# EAGLE design h-bridge_v2 (EAGLE 5.06)
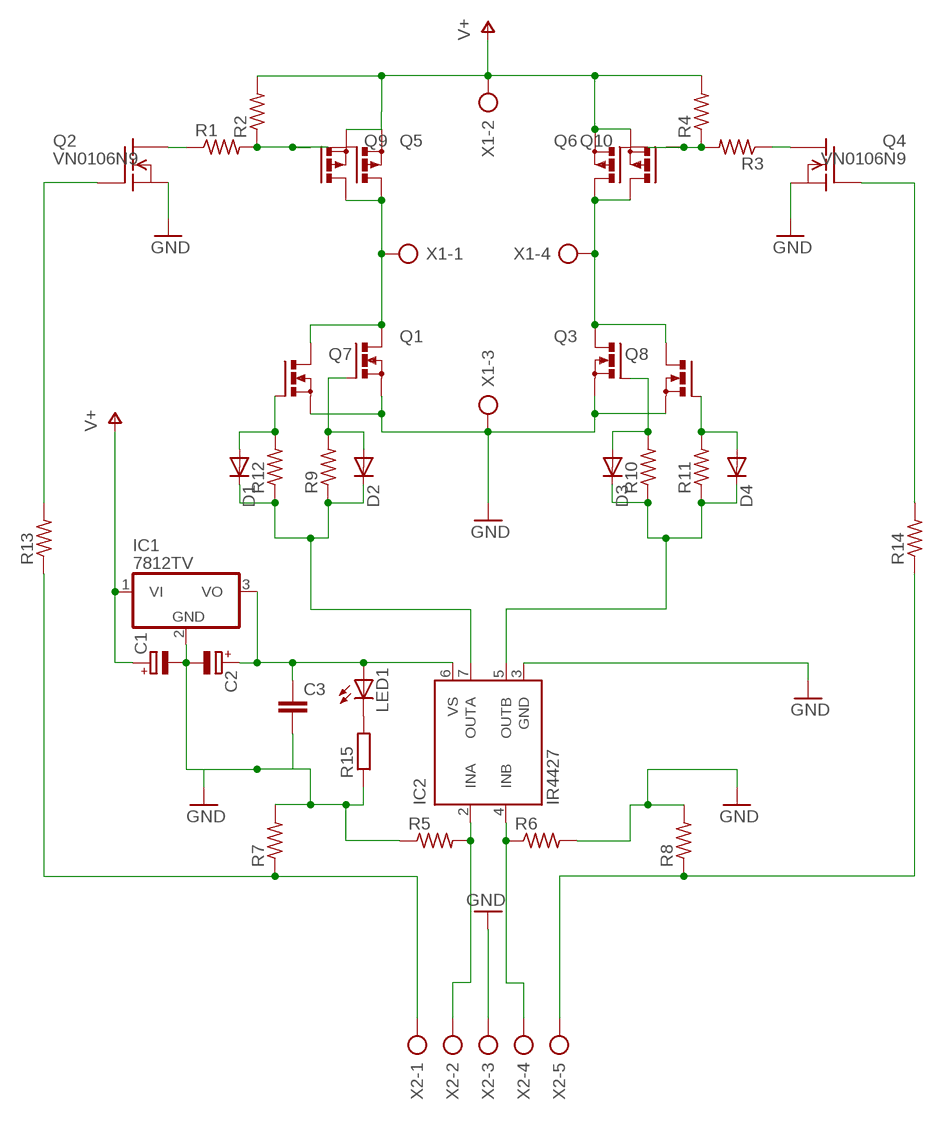
[diagram p0: schematic, sheet 1]

## Parts
C1  CPOL-EUE5-8.5  [E5-8,5]
C2  CPOL-EUE5-8.5  [E5-8,5]
C3  C-EU025-024X044  [C025-024X044]
D1  1N4148DO35-7  DIODE-D-5  [D-5]
D2  1N4148DO35-7  DIODE-D-5  [D-5]
D3  1N4148DO35-7  DIODE-D-5  [D-5]
D4  1N4148DO35-7  DIODE-D-5  [D-5]
IC1  7812TV  [TO220V]
IC2  IR4427  [DIL08]
LED1  LED3MM  [LED3MM]
Q1  PMOSFET_NTO220BV  [TO220BV]
Q2  VN0106N9  [TO-52]
Q3  PMOSFET_NTO220BV  [TO220BV]
Q4  VN0106N9  [TO-52]
Q5  PMOSFET_PTO220BV  [TO220BV]
Q6  PMOSFET_PTO220BV  [TO220BV]
Q7  PMOSFET_NTO220BV  [TO220BV]
Q8  PMOSFET_NTO220BV  [TO220BV]
Q9  PMOSFET_PTO220BV  [TO220BV]
Q10  PMOSFET_PTO220BV  [TO220BV]
R1  R-US_0204/5  [0204/5]
R2  R-US_0204/5  [0204/5]
R3  R-US_0204/5  [0204/5]
R4  R-US_0204/5  [0204/5]
R5  R-US_0204/5  [0204/5]
R6  R-US_0204/5  [0204/5]
R7  R-US_0204/7  [0204/7]
R8  R-US_0204/5  [0204/5]
R9  R-US_0204/5  [0204/5]
R10  R-US_0204/5  [0204/5]
R11  R-US_0204/5  [0204/5]
R12  R-US_0204/5  [0204/5]
R13  R-US_0204/7  [0204/7]
R14  R-US_0204/5  [0204/5]
R15  R-EU_0204/5  [0204/5]
X1  AK500/4  [AK500/4]
X2  AK500/5  [AK500/5]

## Nets
GND: C1.- C2.- C3.2 IC1.2(GND) IC2.3(GND) Q1.S Q2.1(S) Q3.S Q4.1(S) Q7.S Q8.S R5.1 R6.2 R7.2 R8.2 R15.1 X1.3 X2.3
N$1: Q4.2(G) R14.2
N$2: Q5.G Q9.G R1.2 R2.1
N$3: Q6.G Q10.G R3.2 R4.1
N$5: Q1.D Q5.D Q7.D Q9.D X1.1
N$6: Q3.D Q6.D Q8.D Q10.D X1.4
N$7: Q2.3(D) R1.1
N$9: Q4.3(D) R3.1
N$10: R7.1 R13.1 X2.1
N$11: R8.1 R14.1 X2.5
N$12: IC2.4(INB) R6.1 X2.4
N$13: IC2.2(INA) R5.2 X2.2
N$14: D2.A Q1.G R9.2
N$16: C2.+ C3.1 IC1.3(VO) IC2.6(VS) LED1.A
N$17: D3.A Q3.G R10.2
N$18: D3.C D4.C IC2.5(OUTB) R10.1 R11.1
N$19: D1.C D2.C IC2.7(OUTA) R9.1 R12.1
N$20: D1.A Q7.G R12.2
N$21: D4.A Q8.G R11.2
N$22: LED1.K(C) R15.2
N$24: Q2.2(G) R13.2
V+: C1.+ IC1.1(VI) Q5.S Q6.S Q9.S Q10.S R2.2 R4.2 X1.2

## Library data of the parts
C1 C2 = rcl:CPOL-EU: POLARIZED CAPACITOR, European symbol
C3 = rcl:C-EU: CAPACITOR, European symbol
D1-D4 = diode:DIODE-: DIODE
IC1 = linear:78*: Positive VOLTAGE REGULATOR Source: http://cache.national.com/ds/LM/LM78L05.pdf http://www.fairchildsemi.com/ds/LM/LM7805.pdf
IC2 = ir:IR4427: DUAL LOW SIDE DRIVER Source: ID4426.pdf
LED1 = SparkFun:LED: LEDs Standard schematic elements and footprints for 5mm, 3mm, 1206, and 0603 sized LEDs. 5mm - Spark Fun Electronics SKU : COM-00529 (and others)
Q1 Q3 Q7 Q8 = transistor-power:PMOSFET_N: Power MOSFET N-Channel
Q2 Q4 = transistor-fet:VN0106N9: N-Channel Enhancement MOSFET 60V; 0,5A; 3,0Ohm
Q5 Q6 Q9 Q10 = transistor-power:PMOSFET_P: Power MOSFET P-Channel
R1-R4 R7-R14 = resistor:R-US_: RESISTOR, American symbol
R5 R6 = rcl:R-US_: RESISTOR, American symbol
R15 = resistor:R-EU_: RESISTOR, European symbol
X1 = con-ptr500:AK500/4: CONNECTOR
X2 = con-ptr500:AK500/5: CONNECTOR

## Board
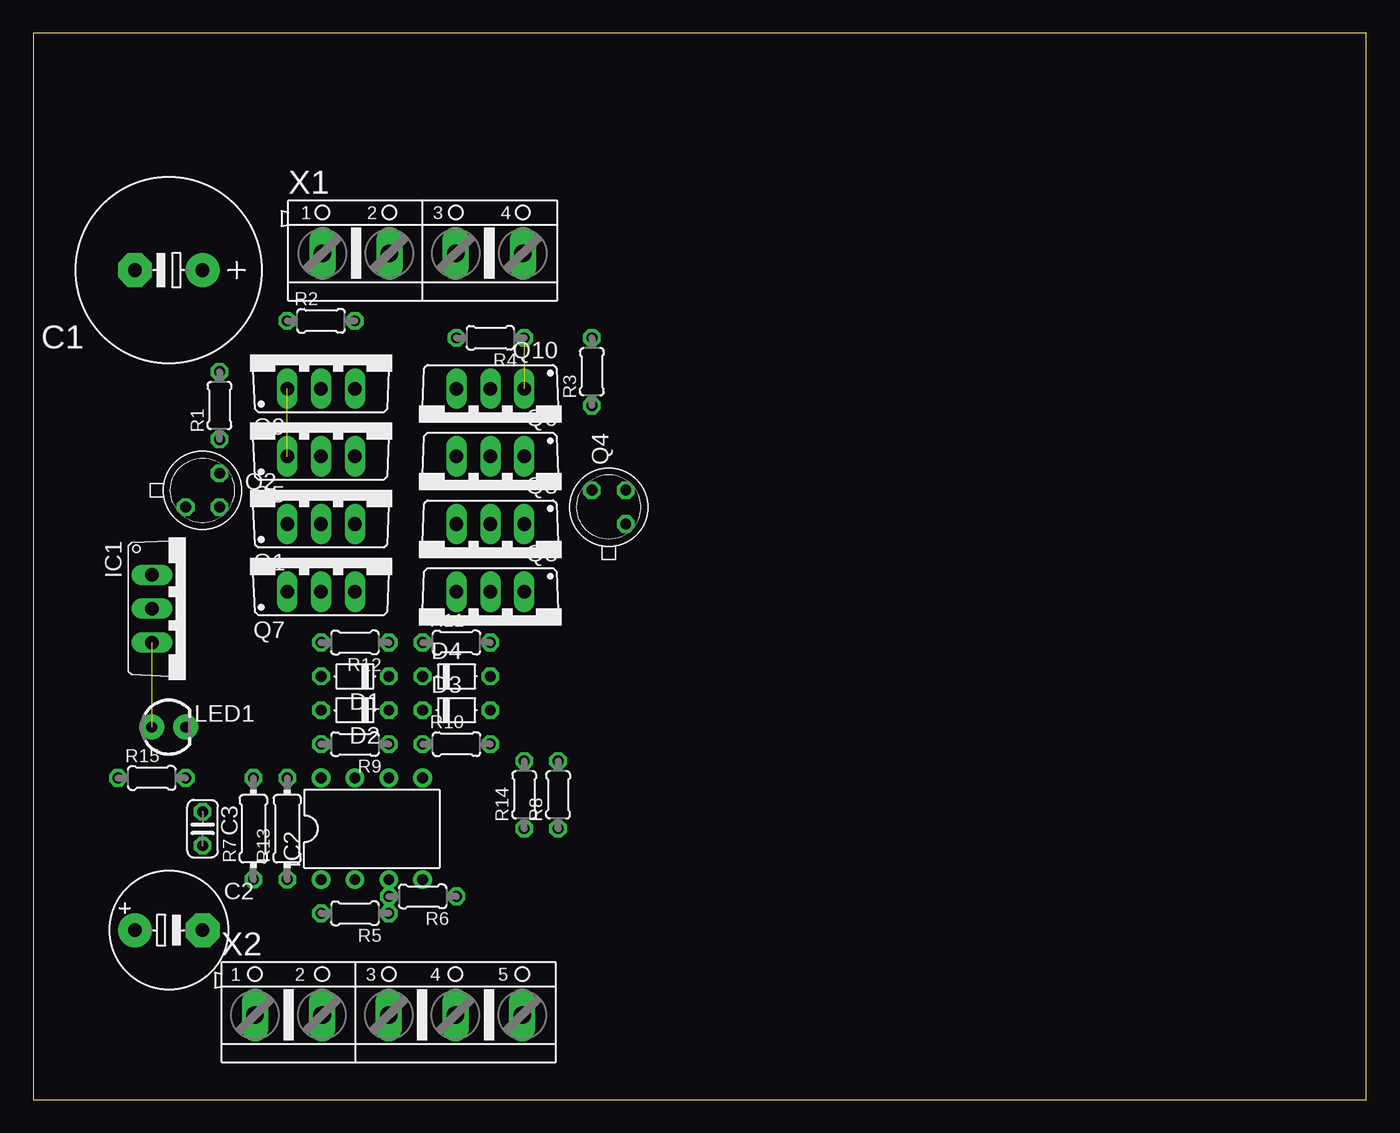
[diagram p1: board, top side]
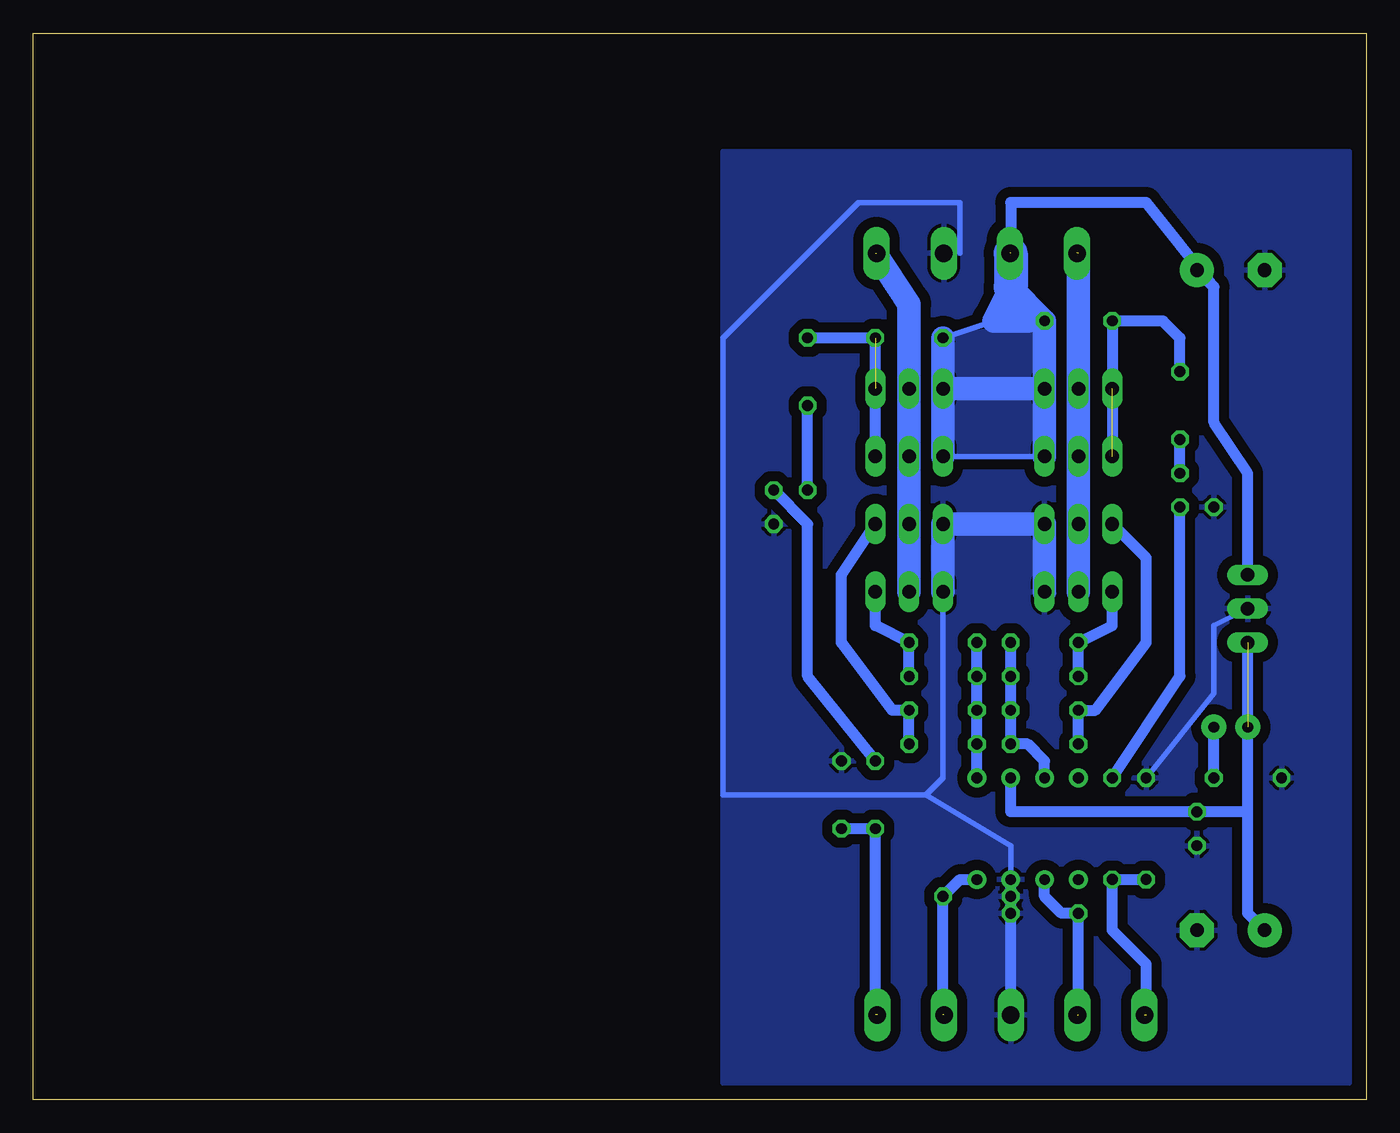
[diagram p2: board, bottom side, seen from below]

Size 100 x 80 mm. Coordinates in mm from the lower left corner, seen from the top.
Outline: 0,0 100,0 100,80 0,80 0,0
Copper layers (1*16): Top 0.035mm / dielectric 1.5mm / Bottom 0.035mm
Design rules "default *": minimum track width 10mil, minimum drill 24mil, track to track 30mil, track to pad 30mil, pad to pad 8mil, via to via 8mil, smd to smd 8mil, copper to edge 40mil, drill to drill 8mil, minimum pad ring 10mil, minimum via ring 8mil, stop-mask expansion 4mil, vias tented up to drill 0mil, thermal gap 10mil

### Footprints (pad centres in the part's own frame; a part is rotated, then mirrored left to right if it is on the bottom)
E5-13 = drill 1.016 pad 2.54 round: + -2.54,0 | drill 1.016 pad 2.54 octagon: - 2.54,0
E5-8,5 = drill 1.016 pad 2.54 round: + -2.54,0 | drill 1.016 pad 2.54 octagon: - 2.54,0
C025-024X044 = drill 0.813 octagon: 1 -1.27,0; 2 1.27,0
D-5 = drill 0.813 octagon: A 2.54,0; C -2.54,0
TO220V = drill 1.016 long: 1 -2.54,-2.54; 2 0,-2.54; 3 2.54,-2.54
DIL08 = drill 0.8 pad 1.4 round: 1 -3.81,-3.81; 2 -1.27,-3.81; 3 1.27,-3.81; 4 3.81,-3.81; 5 3.81,3.81; 6 1.27,3.81; 7 -1.27,3.81; 8 -3.81,3.81
LED3MM = drill 0.813 pad 1.88 round: A -1.27,0; K 1.27,0
TO220BV = drill 1.016 long: D 0,-2.54; G -2.54,-2.54; S 2.54,-2.54
TO-52 = drill 0.813 octagon: 1 -1.27,-1.27; 2 1.27,-1.27; 3 1.27,1.27
0204/5 = drill 0.813 octagon: 1 -2.54,0; 2 2.54,0
0204/7 = drill 0.813 octagon: 1 -3.81,0; 2 3.81,0
AK500/4 = drill 1.321 long: 1 -7.518,0; 2 -2.489,0; 3 2.489,0; 4 7.518,0
AK500/5 = drill 1.321 long: 1 -10.033,0; 2 -5.004,0; 3 0,0; 4 5.004,0; 5 10.008,0

### Placement (x,y rotation side)
C1  [E5-13]  10.16,62.23 180 top
C2  10.16,12.7 0 top
C3  12.7,20.32 270 top
D1  24.13,31.75 180 top
D2  24.13,29.21 180 top
D3  31.75,29.21 0 top
D4  31.75,31.75 0 top
IC1  11.43,36.83 270 top
IC2  25.4,20.32 0 top
LED1  10.16,27.94 0 top
Q1  21.59,45.72 0 top
Q2  12.7,45.72 0 top
Q3  34.29,40.64 180 top
Q4  43.18,44.45 90 top
Q5  21.59,50.8 0 top
Q6  34.29,45.72 180 top
Q7  21.59,40.64 0 top
Q8  34.29,35.56 180 top
Q9  21.59,55.88 0 top
Q10  34.29,50.8 180 top
R1  13.97,52.07 90 top
R2  21.59,58.42 0 top
R3  41.91,54.61 90 top
R4  34.29,57.15 180 top
R5  24.13,13.97 180 top
R6  29.21,15.24 180 top
R7  16.51,20.32 90 top
R8  39.37,22.86 90 top
R9  24.13,26.67 180 top
R10  31.75,26.67 0 top
R11  31.75,34.29 0 top
R12  24.13,34.29 180 top
R13  19.05,20.32 90 top
R14  36.83,22.86 90 top
R15  8.89,24.13 0 top
X1  29.21,63.5 0 top
X2  26.67,6.35 0 top

### Tracks (layer width: path | path; a pad name or v marks a point on that pad's centre or on a via)
GND
  Bottom 0.406: IC2.3 26.67,19.05 33.02,22.86 | 30.48,63.5 30.48,67.31 38.1,67.31 48.26,57.15 48.26,22.86 33.02,22.86 | R7.2 11.43,30.48 11.43,35.56 IC1.2 | Q8.S 31.75,24.13 33.02,22.86
  Bottom 0.813: IC2.3 R5.1 X2.3
  Bottom 1.778: Q7.S Q1.S Q3.S Q8.S
  pour Bottom: 1.27,71.12 48.26,71.12 48.26,1.27 1.27,1.27
N$1
  Bottom 0.813: R14.2 41.91,31.75 41.91,43.18 Q4.2
N$2  (1 unrouted)
  Bottom 0.813: R1.2 13.97,57.15 15.24,58.42 R2.1 Q5.G
N$3  (1 unrouted)
  Bottom 0.813: Q6.G R4.1 R3.2
N$5  (1 unrouted)
  Bottom 1.778: Q7.D Q1.D Q5.D Q9.D 21.59,63.5
N$6  (1 unrouted)
  Bottom 1.778: Q8.D Q3.D Q6.D Q10.D 34.29,59.69 36.83,63.5
N$7
  Bottom 0.813: Q2.3 R1.1
N$9
  Bottom 0.813: Q4.3 R3.1
N$10  (1 unrouted)
  Bottom 0.813: R7.1 R13.1 19.05,12.7 16.51,10.16 16.51,6.35
N$11  (1 unrouted)
  Bottom 0.813: R14.1 R8.1 R14.1 | 36.83,6.35 R14.1
N$12  (1 unrouted)
  Bottom 0.813: IC2.4 30.48,16.51 R6.1 31.75,6.35
N$13  (1 unrouted)
  Bottom 0.813: IC2.2 24.13,15.24 22.86,13.97 R5.2 21.59,6.35
N$14
  Bottom 0.813: Q1.G 16.51,40.64 16.51,34.29 20.32,29.21 D2.A | R9.2 D2.A | R9.2 D2.A | R9.2 D2.A | R9.2 D2.A
N$16  (1 unrouted)
  Bottom 0.813: IC2.6 26.67,21.59 C3.1 8.89,21.59 | C2.+ 8.89,13.97 8.89,21.59 | 8.89,21.59 IC1.3
N$17
  Bottom 0.813: D3.A R10.2 D3.A | D3.A 35.56,29.21 39.37,34.29 39.37,39.37 Q3.G
N$18
  Bottom 0.813: R10.1 IC2.5 R10.1 | R10.1 D3.C | D3.C D4.C | D4.C R11.1 D4.C | R10.1 D3.C | D3.C D4.C
N$19
  Bottom 0.813: R9.1 D2.C | D2.C D1.C | D1.C R12.1 D1.C | IC2.7 24.13,25.4 25.4,26.67 R9.1 | D2.C D1.C | R9.1 D2.C
N$20
  Bottom 0.813: Q7.G 19.05,35.56 R12.2 D1.A
N$21
  Bottom 0.813: Q8.G 36.83,35.56 R11.2 D4.A
N$22
  Bottom 0.813: R15.2 LED1.K
N$24
  Bottom 0.813: R13.2 13.97,31.75 Q2.2
V+  (1 unrouted)
  Bottom 0.406: Q5.S Q6.S | R2.2 25.4,58.42 | 27.94,58.42 R4.2
  Bottom 0.813: 11.43,60.96 16.51,67.31 26.67,67.31 26.67,63.5 | IC1.1 8.89,46.99 11.43,50.8 11.43,60.96 | 11.43,60.96 C1.+
  Bottom 1.778: Q9.S R2.2 26.67,60.96 | Q9.S Q5.S | Q10.S Q6.S R4.2 Q10.S | Q9.S Q10.S | 26.67,60.96 25.4,58.42 27.94,58.42 26.67,60.96
  Bottom 2.54: 26.67,63.5 26.67,60.96
  pour Bottom: 24.13,58.42 24.13,48.26 31.75,48.26 31.75,57.15